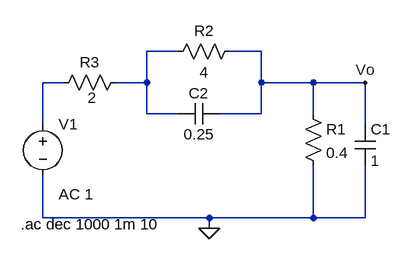
[diagram p0: schematic Circuito_Y.asc]
Circuito_Y.asc, the LTspice schematic file:
Version 4
SHEET 1 880 680
WIRE 176 112 128 112
WIRE 304 112 256 112
WIRE 0 160 -32 160
WIRE 128 160 128 112
WIRE 128 160 80 160
WIRE 304 160 304 112
WIRE 384 160 304 160
WIRE 464 160 384 160
WIRE 128 208 128 160
WIRE 176 208 128 208
WIRE 304 208 304 160
WIRE 304 208 240 208
WIRE 384 208 384 160
WIRE -32 224 -32 160
WIRE 464 224 464 160
WIRE -32 368 -32 304
WIRE 224 368 -32 368
WIRE 384 368 384 288
WIRE 384 368 224 368
WIRE 464 368 464 288
WIRE 464 368 384 368
WIRE 224 384 224 368
FLAG 224 384 0
FLAG 464 160 Vo
SYMBOL res 96 144 R90
WINDOW 0 0 56 VBottom 2
WINDOW 3 55 52 VBottom 2
SYMATTR InstName R3
SYMATTR Value 2
SYMBOL voltage -32 208 R0
WINDOW 123 24 124 Left 2
WINDOW 39 0 0 Left 0
SYMATTR InstName V1
SYMATTR Value ""
SYMATTR Value2 AC 1
SYMBOL res 368 192 R0
SYMATTR InstName R1
SYMATTR Value 0.4
SYMBOL cap 448 224 R0
SYMATTR InstName C1
SYMATTR Value 1
SYMBOL cap 240 192 R90
WINDOW 0 0 32 VBottom 2
WINDOW 3 32 32 VTop 2
SYMATTR InstName C2
SYMATTR Value 0.25
SYMBOL res 272 96 R90
WINDOW 0 0 56 VBottom 2
WINDOW 3 32 56 VTop 2
SYMATTR InstName R2
SYMATTR Value 4
TEXT -66 378 Left 2 !.ac dec 1000 1m 10

The netlist it stands for:
* Circuito_Y.asc
R3 N001 N002 2
V1 N002 0 AC 1
R1 Vo 0 0.4
C1 Vo 0 1
C2 Vo N001 0.25
R2 Vo N001 4
.ac dec 1000 1m 10
.backanno
.end